# Altium project jetson-tx-baseboard.PrjPcb (part 2 of 2)
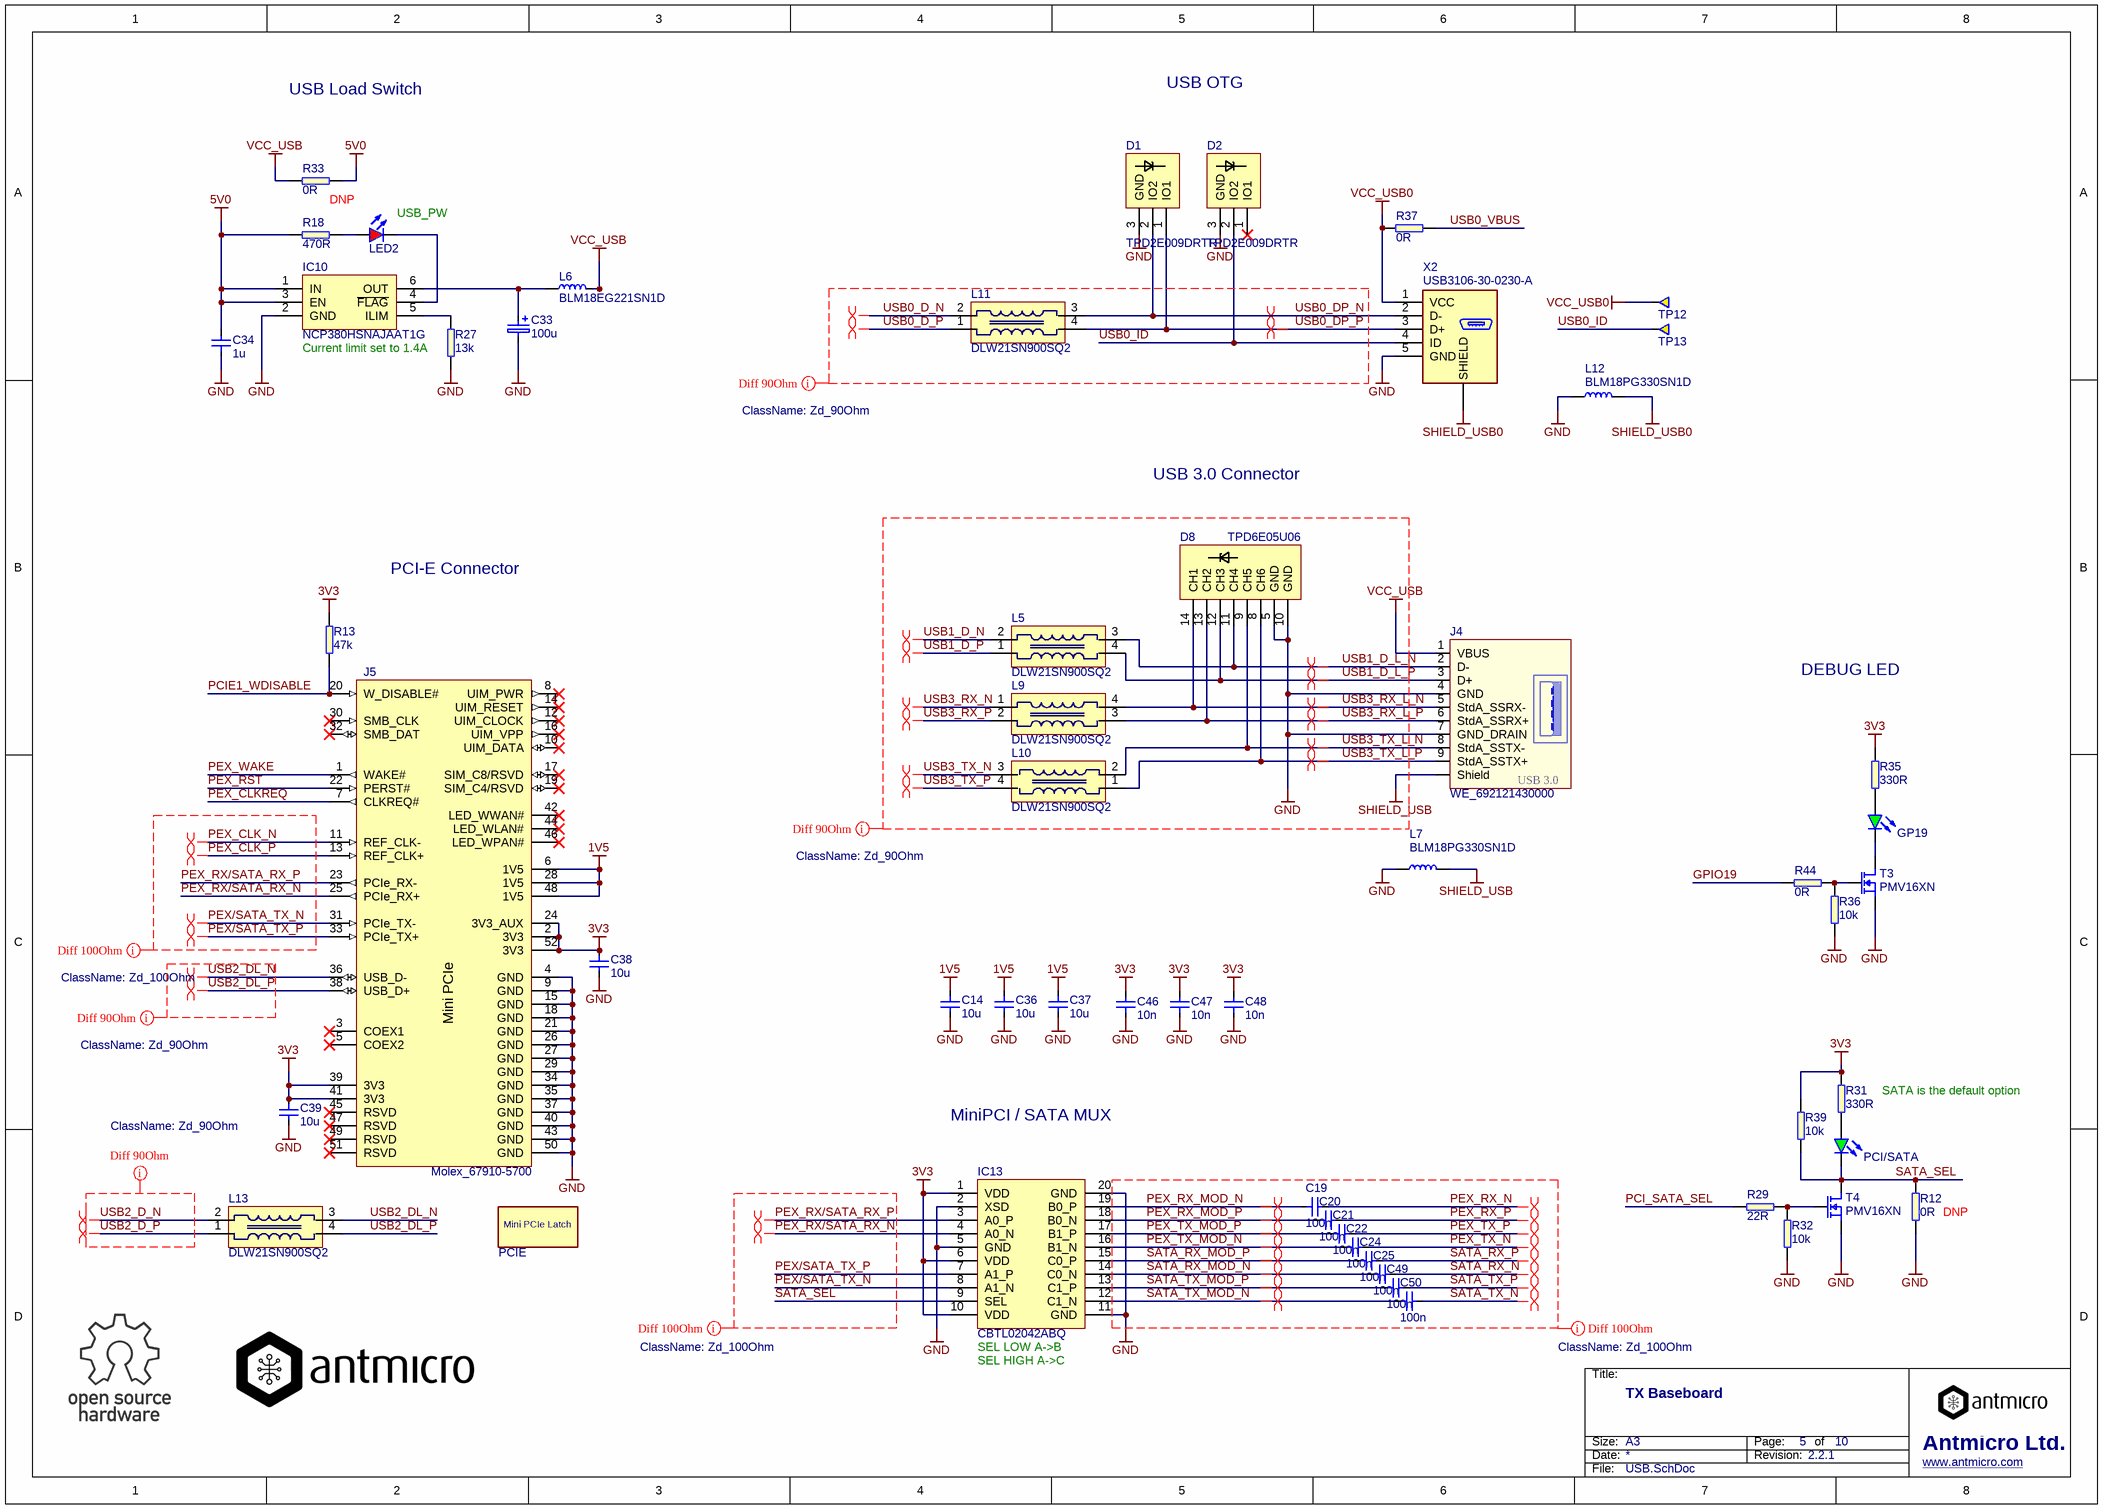
[diagram p10: USB.SchDoc]

## Nets that join several sheets
1V5: Supply (C13.2 IC4.4 L8.2 TP5.1), USB (6 pins)
1V8: Camera (J2.80), HDMI (5 pins), ID-Serial (19 pins), Misc (R3.2 R34.2), Supply (C9.1 C10.1 IC3.6 TP3.1), UART (IC9.1)
3V3: Supply (C8.1 IC5.2 IC5.4 TP6.1), USB (17 pins)
5V0: HDMI (7 pins), Misc (C43.2 C52.2 J6.2 R21.2), Supply (10 pins), USB (5 pins)
5V0_STB: Misc (9 pins), Supply (C35.1 IC7.2 IC7.4 TP4.1)
GND: Camera (27 pins), Ethernet (C15.2), HDMI (13 pins), ID-Serial (19 pins), Misc (16 pins), Supply (109 pins), UART (14 pins), USB (44 pins)
VIN: Camera (5 pins), Supply (15 pins)
CAM_SCL_1V8: Camera (J2.53), SoM-Interfaces (IC8.C6)
CAM_SDA_1V8: Camera (J2.55), SoM-Interfaces (IC8.D6)
CAM_UART_RX_1V8: Camera (J2.61), SoM-Interfaces (IC8.D10)
CAM_UART_TX_1V8: Camera (J2.59), SoM-Interfaces (IC8.D9)
CSI0_CLK_N: Camera (J2.9), SoM-Interfaces (IC8.G27)
CSI0_CLK_P: Camera (J2.7), SoM-Interfaces (IC8.G28)
CSI0_D0_N: Camera (J2.3), SoM-Interfaces (IC8.F28)
CSI0_D0_P: Camera (J2.1), SoM-Interfaces (IC8.F29)
CSI0_D1_N: Camera (J2.15), SoM-Interfaces (IC8.H26)
CSI0_D1_P: Camera (J2.13), SoM-Interfaces (IC8.H27)
CSI1_CLK_N: Camera (J2.10), SoM-Interfaces (IC8.D27)
CSI1_CLK_P: Camera (J2.8), SoM-Interfaces (IC8.D28)
CSI1_D0_N: Camera (J2.4), SoM-Interfaces (IC8.C28)
CSI1_D0_P: Camera (J2.2), SoM-Interfaces (IC8.C29)
CSI1_D1_N: Camera (J2.16), SoM-Interfaces (IC8.E26)
CSI1_D1_P: Camera (J2.14), SoM-Interfaces (IC8.E27)
CSI2_CLK_N: Camera (J2.27), SoM-Interfaces (IC8.G24)
CSI2_CLK_P: Camera (J2.25), SoM-Interfaces (IC8.G25)
CSI2_D0_N: Camera (J2.21), SoM-Interfaces (IC8.F25)
CSI2_D0_P: Camera (J2.19), SoM-Interfaces (IC8.F26)
CSI2_D1_N: Camera (J2.33), SoM-Interfaces (IC8.H23)
CSI2_D1_P: Camera (J2.31), SoM-Interfaces (IC8.H24)
CSI3_CLK_N: Camera (J2.28), SoM-Interfaces (IC8.D24)
CSI3_CLK_P: Camera (J2.26), SoM-Interfaces (IC8.D25)
CSI3_D0_N: Camera (J2.22), SoM-Interfaces (IC8.C25)
CSI3_D0_P: Camera (J2.20), SoM-Interfaces (IC8.C26)
CSI3_D1_N: Camera (J2.34), SoM-Interfaces (IC8.E23)
CSI3_D1_P: Camera (J2.32), SoM-Interfaces (IC8.E24)
CSI4_CLK_N: Camera (J2.43), SoM-Interfaces (IC8.G21)
CSI4_CLK_P: Camera (J2.41), SoM-Interfaces (IC8.G22)
CSI4_D0_N: Camera (J2.39), SoM-Interfaces (IC8.F22)
CSI4_D0_P: Camera (J2.37), SoM-Interfaces (IC8.F23)
CSI4_D1_N: Camera (J2.49), SoM-Interfaces (IC8.H20)
CSI4_D1_P: Camera (J2.47), SoM-Interfaces (IC8.H21)
CSI5_CLK_N: Camera (J2.44), SoM-Interfaces (IC8.D21)
CSI5_CLK_P: Camera (J2.42), SoM-Interfaces (IC8.D22)
CSI5_D0_N: Camera (J2.40), SoM-Interfaces (IC8.C22)
CSI5_D0_P: Camera (J2.38), SoM-Interfaces (IC8.C23)
CSI5_D1_N: Camera (J2.50), SoM-Interfaces (IC8.E20)
CSI5_D1_P: Camera (J2.48), SoM-Interfaces (IC8.E21)
DBG_UART_RxD_1V8: SoM-Interfaces (IC8.G12), UART (R40.2)
DBG_UART_TxD_1V8: SoM-Interfaces (IC8.H12), UART (R41.2)
FAN_PWM: Misc (R3.1 R23.2 T5.1), Supply (IC8.C16)
FAN_TACH: Misc (C45.2 J6.3 R34.1), Supply (IC8.B17)
FORCE_RECOV: Misc (R28.2), Supply (IC8.E1)
GBE_MDI0_N: Ethernet (T1.12), SoM-Interfaces (IC8.E49)
GBE_MDI0_P: Ethernet (T1.11), SoM-Interfaces (IC8.E48)
GBE_MDI1_N: Ethernet (T1.9), SoM-Interfaces (IC8.F48)
GBE_MDI1_P: Ethernet (T1.8), SoM-Interfaces (IC8.F47)
GBE_MDI2_N: Ethernet (T1.6), SoM-Interfaces (IC8.G49)
GBE_MDI2_P: Ethernet (T1.5), SoM-Interfaces (IC8.G48)
GBE_MDI3_N: Ethernet (T1.3), SoM-Interfaces (IC8.H48)
GBE_MDI3_P: Ethernet (T1.2), SoM-Interfaces (IC8.H47)
GPIO0_CAM0_PWR: Camera (J2.60), SoM-Interfaces (IC8.G8)
GPIO1_CAM1_PWR: Camera (J2.68), SoM-Interfaces (IC8.F7)
GPIO2_CAM0_RST: Camera (J2.62), SoM-Interfaces (IC8.H8)
GPIO3_CAM1_RST: Camera (J2.70), SoM-Interfaces (IC8.H7)
GPIO4_CAM_STROBE: Camera (J2.64), SoM-Interfaces (IC8.G7)
GPIO5_CAM_FLASH_EN: Camera (J2.66), SoM-Interfaces (IC8.D7)
GPIO19: SoM-Interfaces (IC8.F2), USB (R44.1)
I2C_GP0_SCL_1V8: Camera (J2.56), ID-Serial (IC14.14 IC15.6 R26.1), SoM-Interfaces (IC8.E15)
I2C_GP0_SDA_1V8: Camera (J2.54), ID-Serial (IC14.15 IC15.5 R42.1), SoM-Interfaces (IC8.D15)
PCI_SATA_SEL: SoM-Interfaces (IC8.B21), USB (R29.1)
PEX_CLK_N: SoM-Interfaces (IC8.A45), USB (J5.11)
PEX_CLK_P: SoM-Interfaces (IC8.A44), USB (J5.13)
PEX_CLKREQ: SoM-Interfaces (IC8.C48), USB (J5.7)
PEX_RST: SoM-Interfaces (IC8.C49), USB (J5.22)
PEX_RX_N: SoM-Interfaces (IC8.H45), USB (C19.2)
PEX_RX_P: SoM-Interfaces (IC8.H44), USB (C20.2)
PEX_TX_N: SoM-Interfaces (IC8.E45), USB (C22.2)
PEX_TX_P: SoM-Interfaces (IC8.E44), USB (C21.2)
PEX_WAKE: SoM-Interfaces (IC8.D48), USB (J5.1)
POWER_BTN: Misc (R24.2), Supply (IC8.B50)
SATA_RX_N: SoM-Interfaces (IC8.G46), USB (C25.2)
SATA_RX_P: SoM-Interfaces (IC8.G45), USB (C24.2)
SATA_TX_N: SoM-Interfaces (IC8.D46), USB (C50.2)
SATA_TX_P: SoM-Interfaces (IC8.D45), USB (C49.2)
SPI2_CLK_1V8: Camera (J2.73), SoM-Interfaces (IC8.H14)
SPI2_CS0_1V8: Camera (J2.67), SoM-Interfaces (IC8.G16)
SPI2_CS1_1V8: Camera (J2.65), SoM-Interfaces (IC8.F16)
SPI2_MISO_1V8: Camera (J2.71), SoM-Interfaces (IC8.H15)
SPI2_MOSI_1V8: Camera (J2.69), SoM-Interfaces (IC8.G15)
TMDS_CLK_N: HDMI (C60.1), SoM-Interfaces (IC8.E35)
TMDS_CLK_P: HDMI (C58.1), SoM-Interfaces (IC8.E36)
TMDS_D0_N: HDMI (C59.1), SoM-Interfaces (IC8.D36)
TMDS_D0_P: HDMI (C56.1), SoM-Interfaces (IC8.D37)
TMDS_D1_N: HDMI (C57.1), SoM-Interfaces (IC8.C37)
TMDS_D1_P: HDMI (C55.1), SoM-Interfaces (IC8.C38)
TMDS_D2_N: HDMI (C54.1), SoM-Interfaces (IC8.E38)
TMDS_D2_P: HDMI (C53.1), SoM-Interfaces (IC8.E39)
TMDS_HPD: HDMI (R20.1 T2.3), SoM-Interfaces (IC8.A33)
TMDS_SCL_1V8: HDMI (IC6.8 R10.1), SoM-Interfaces (IC8.A35)
TMDS_SDA_1V8: HDMI (IC6.1 R11.1), SoM-Interfaces (IC8.A34)
USB0_D_N: SoM-Interfaces (IC8.B40), USB (L11.2)
USB0_D_P: SoM-Interfaces (IC8.B39), USB (L11.1)
USB0_ID: SoM-Interfaces (IC8.A36), USB (D2.2 TP13.1 X2.4)
USB0_VBUS: SoM-Interfaces (IC8.B37), USB (R37.2)
USB1_D_N: SoM-Interfaces (IC8.A39), USB (L5.2)
USB1_D_P: SoM-Interfaces (IC8.A38), USB (L5.1)
USB2_D_N: SoM-Interfaces (IC8.B43), USB (L13.2)
USB2_D_P: SoM-Interfaces (IC8.B42), USB (L13.1)
USB3_RX_N: SoM-Interfaces (IC8.F44), USB (L9.1)
USB3_RX_P: SoM-Interfaces (IC8.F43), USB (L9.2)
USB3_TX_N: SoM-Interfaces (IC8.C44), USB (L10.3)
USB3_TX_P: SoM-Interfaces (IC8.C43), USB (L10.4)
VIN_PWR_BAD: Misc (R47.2), Supply (IC8.B8)

## Assembly variants
Production: not fitted L2 M5 R2 R12 R23 R25 R33 R49 R50 R54 R57 R58 R59 R61 R62 R63 R67 R68 R71